# EAGLE design ph762Shield (EAGLE 5.11)
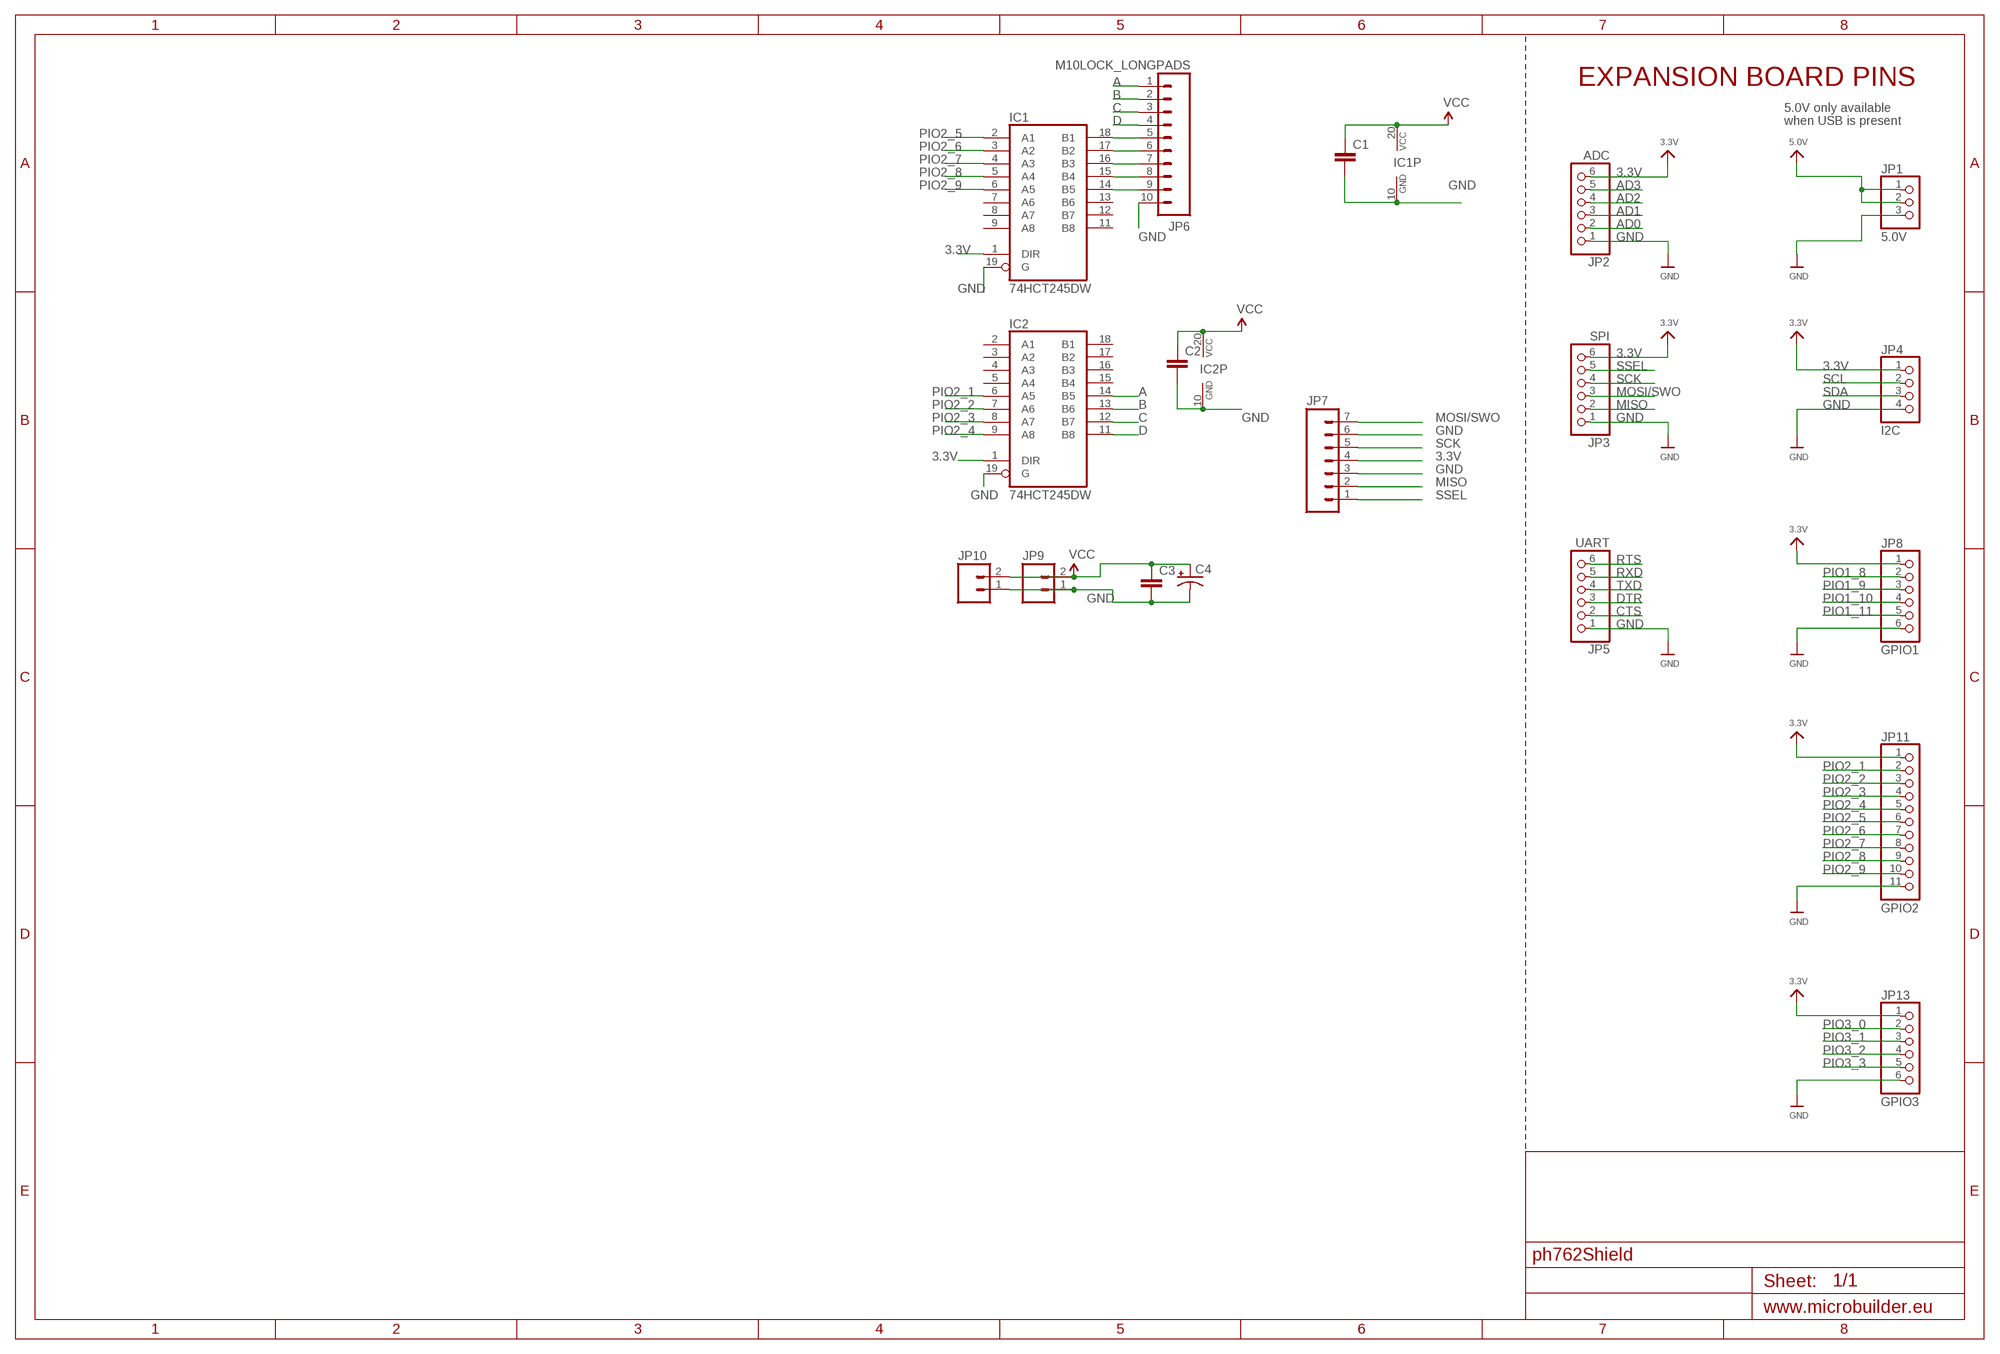
[diagram p0: schematic, sheet 1]

## Parts
C1  CAP0805  [0805]
C2  CAP0805  [0805]
C3  CAP0805  [0805]
C4  CAP_POLC  [PANASONIC_C]
IC1  74HCT245DW  [SO20W]
IC2  74HCT245DW  [SO20W]
JP1  5.0V  HEADER-1X3ROUND  [1X03_ROUND]
JP2  ADC  HEADER-1X6ROUND  [1X06_ROUND]
JP3  SPI  HEADER-1X6ROUND  [1X06_ROUND]
JP4  I2C  HEADER-1X4ROUND  [1X04_ROUND]
JP5  UART  HEADER-1X6ROUND  [1X06_ROUND]
JP6  M10LOCK_LONGPADS  [1X10_LOCK_LONGPADS]
JP7  M07LOCK_LONGPADS  [1X07_LOCK_LONGPADS]
JP8  GPIO1  HEADER-1X6ROUND  [1X06_ROUND]
JP9  M02LOCK_LONGPADS  [1X02_LOCK_LONGPADS]
JP10  M02LOCK_LONGPADS  [1X02_LOCK_LONGPADS]
JP11  GPIO2  HEADER-1X11  [1X11_ROUND]
JP13  GPIO3  HEADER-1X6ROUND  [1X06_ROUND]

## Nets
3.3V: IC1.1(DIR) IC2.1(DIR) JP2.6 JP3.6 JP4.1 JP7.4 JP8.1 JP11.1 JP13.1
5.0V: JP1.1 JP1.2
A: IC2.14(B5) JP6.1
AD0: JP2.2
AD1: JP2.3
AD2: JP2.4
AD3: JP2.5
B: IC2.13(B6) JP6.2
C: IC2.12(B7) JP6.3
CLK: IC1.17(B2) JP6.6
CTS: JP5.2
D: IC2.11(B8) JP6.4
DTR: JP5.3
EN: IC1.14(B5) JP6.9
G: IC1.15(B4) JP6.8
GND: C1.2 C2.2 C3.2 C4.- IC1.10(GND) IC1.19(G) IC2.10(GND) IC2.19(G) JP1.3 JP2.1 JP3.1 JP4.4 JP5.1 JP6.10 JP7.3 JP7.6 JP8.6 JP9.1 JP10.1 JP11.11 JP13.6
MISO: JP3.2 JP7.2
MOSI/SWO: JP3.3 JP7.7
PIO1_8: JP8.2
PIO1_9: JP8.3
PIO1_10: JP8.4
PIO1_11: JP8.5
PIO2_1: IC2.6(A5) JP11.2
PIO2_2: IC2.7(A6) JP11.3
PIO2_3: IC2.8(A7) JP11.4
PIO2_4: IC2.9(A8) JP11.5
PIO2_5: IC1.2(A1) JP11.6
PIO2_6: IC1.3(A2) JP11.7
PIO2_7: IC1.4(A3) JP11.8
PIO2_8: IC1.5(A4) JP11.9
PIO2_9: IC1.6(A5) JP11.10
PIO3_0: JP13.2
PIO3_1: JP13.3
PIO3_2: JP13.4
PIO3_3: JP13.5
R: IC1.16(B3) JP6.7
RTS: JP5.6
RXD: JP5.5
SCK: JP3.4 JP7.5
SCL: JP4.2
SDA: JP4.3
SSEL: JP3.5 JP7.1
STB: IC1.18(B1) JP6.5
TXD: JP5.4
VCC: C1.1 C2.1 C3.1 C4.+ IC1.20(VCC) IC2.20(VCC) JP9.2 JP10.2
Unconnected: IC1.7(A6) IC1.8(A7) IC1.9(A8) IC1.11(B8) IC1.12(B7) IC1.13(B6) IC2.2(A1) IC2.3(A2) IC2.4(A3) IC2.5(A4) IC2.15(B4) IC2.16(B3) IC2.17(B2) IC2.18(B1)

## Notes on the sheet
- EXPANSION BOARD PINS
- 5.0V only available
- when USB is present

## Library data of the parts
C1-C3 = SparkFun:CAP: Capacitor Standard 0603 ceramic capacitor, and 0.1" leaded capacitor.
C4 = SparkFun:CAP_POL: Capacitor Polarized These are standard SMD and PTH capacitors. Normally 10uF, 47uF, and 100uF in electrolytic and tantalum varieties. Always verify the external diameter of the through hole cap, it varies with capacity, voltage, and manufacturer. The EIA devices should be standard.
IC1 IC2 = 74xx-eu:74*245: Octal BUS TRANSCEIVER, 3-state
JP1 = microbuilder:HEADER-1X3: PIN HEADER
JP2 JP3 JP5 JP8 JP13 = microbuilder:HEADER-1X6: PIN HEADER
JP4 = microbuilder:HEADER-1X4: PIN HEADER
JP6 = SparkFun:M10: Header 10 Standard 10-pin 0.1" header. Use with straight break away headers (SKU : PRT-00116), right angle break away headers (PRT-00553), swiss pins (PRT-00743), machine pins (PRT-00117), and female headers (PRT-00115).
JP7 = SparkFun:M07: Header 7 Standard 7-pin 0.1" header. Use with straight break away headers (SKU : PRT-00116), right angle break away headers (PRT-00553), swiss pins (PRT-00743), machine pins (PRT-00117), and female headers (PRT-00115). NOTES ON THE VARIANTS LOCK and LOCK_LONGPADS... This footprint was designed to help hold the alignment of a through-hole component (i.e. 7-pin header) while soldering it into place. You may notice that each hole has been shifted either up or down by 0.005 of an inch from it's more standard position (which is usually a perfectly straight line). This slight alteration caused the pins (the squares in the middle) to touch the edges of the holes. Because they are alternating, it causes a "brace" to hold the header in place. 0.005 has proven to be the perfect amount of "off-center" position when using our standard breakaway headers. Although looks a little odd when you look at the bare footprint, once you have a header in there, the alteration is very hard to notice. Also, if you push a header all the way into place, it is covered up entirely on the bottom side. This idea of altering the position of holes to aid alignment will be further integrated into the Sparkfun Library for other footprints. It can help hold any component with 3 or more connection pins.
JP9 JP10 = SparkFun:M02: Header 2 Standard 2-pin 0.1" header. Use with straight break away headers (SKU : PRT-00116), right angle break away headers (PRT-00553), swiss pins (PRT-00743), machine pins (PRT-00117), and female headers (PRT-00115). Molex polarized connector foot print use with SKU : PRT-08233 with associated crimp pins and housings.
JP11 = microbuilder:HEADER-1X11

## Board
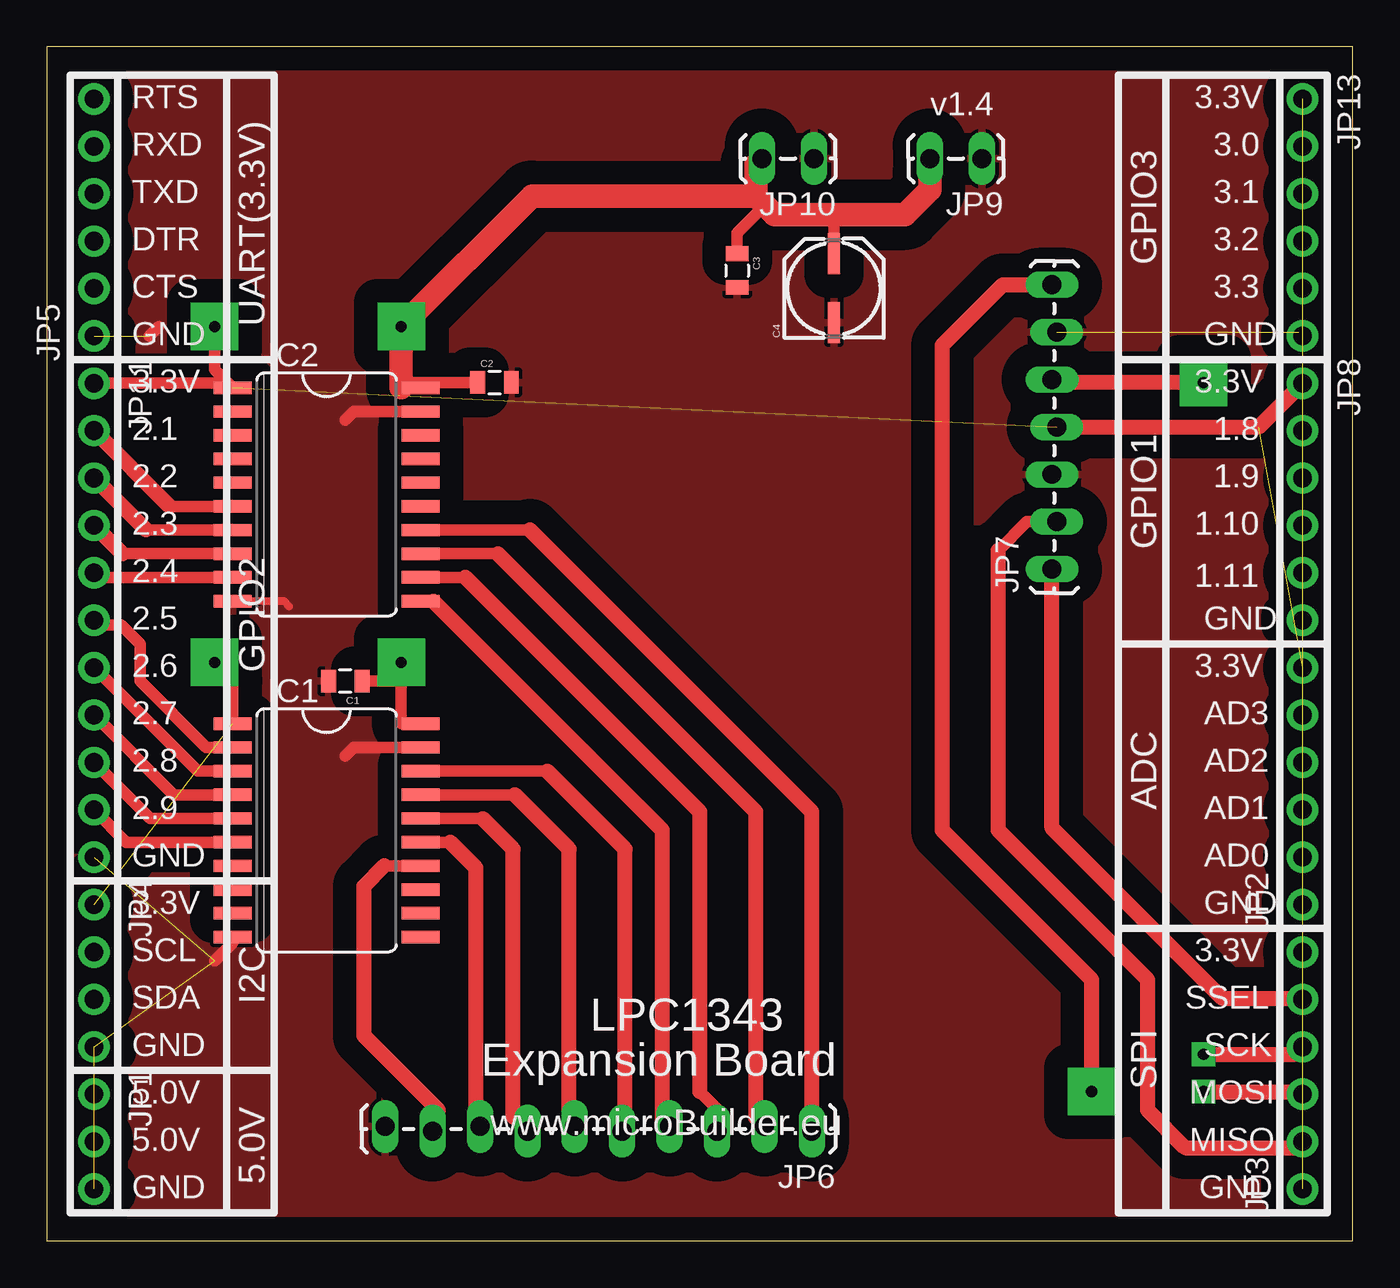
[diagram p1: board, top side]
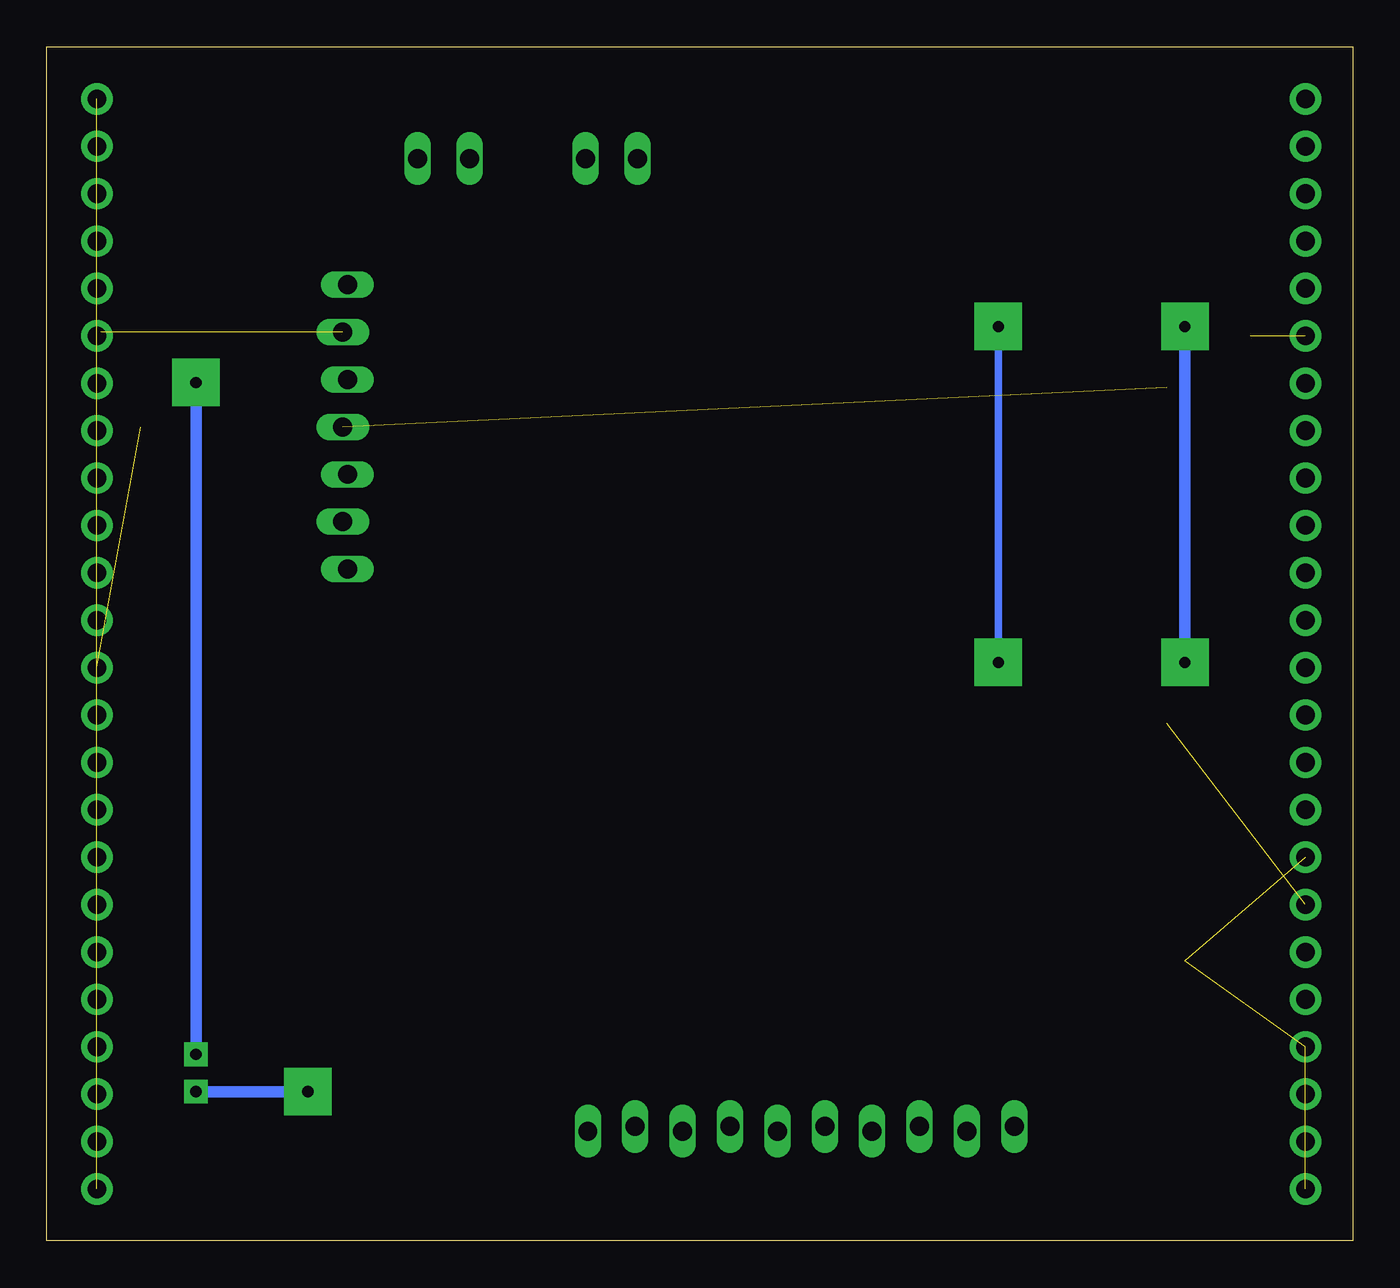
[diagram p2: board, bottom side, seen from below]

Size 70 x 64 mm. Coordinates in mm from the lower left corner, seen from the top.
Outline: 0,0 70,0 70,64 0,64 0,0
Copper layers (1*16): Top 0.035mm / dielectric 1.5mm / Bottom 0.035mm
Design rules "PCBCart-.1mmAnnulars": minimum track width 8mil, minimum drill 0.4mm, track to track 8mil, track to pad 8mil, pad to pad 8mil, via to via 8mil, smd to smd 8mil, copper to edge 20mil, drill to drill 8mil, minimum pad ring 8mil, minimum via ring 4mil, stop-mask expansion 3mil, vias tented up to drill 0mil, thermal gap 8mil
tRestrict: area 2.3,49.4 to 2.7,49.5; area 3.5,48.3 to 3.5,48.7; area 2.3,47.5 to 2.7,47.6; area 4.5,20.4 to 4.5,20.8; area 2.3,19.6 to 2.7,19.6; area 2.3,11.3 to 2.7,11.4; area 3.5,10.2 to 3.5,10.6; area 2.3,9.4 to 2.7,9.5; area 2.3,3.7 to 2.7,3.8; area 3.5,2.6 to 3.5,3; area 2.3,1.8 to 2.7,1.8; area 66.4,2.6 to 66.4,3; 11 more areas

### Footprints (pad centres in the part's own frame; a part is rotated, then mirrored left to right if it is on the bottom)
0805 = smd 0.8 x 1.2: 1 -0.9,0; 2 0.9,0
PANASONIC_C = smd 2.2 x 0.65: + 1.9,-0.2; - -1.8,-0.2
SO20W = smd 0.66 x 2.032: 1 -5.715,-5.029; 2 -4.445,-5.029; 3 -3.175,-5.029; 4 -1.905,-5.029; 5 -0.635,-5.029; 6 0.635,-5.029; 7 1.905,-5.029; 8 3.175,-5.029; 9 4.445,-5.029; 10 5.715,-5.029; 11 5.715,5.029; 12 4.445,5.029; 13 3.175,5.029; 14 1.905,5.029; 15 0.635,5.029; 16 -0.635,5.029; 17 -1.905,5.029; 18 -3.175,5.029; 19 -4.445,5.029; 20 -5.715,5.029
1X03_ROUND = drill 1 pad 1.676 round: 1 -2.54,0; 2 0,0; 3 2.54,0
1X06_ROUND = drill 1 pad 1.676 round: 1 -6.35,0; 2 -3.81,0; 3 -1.27,0; 4 1.27,0; 5 3.81,0; 6 6.35,0
1X04_ROUND = drill 1 pad 1.676 round: 1 -3.81,0; 2 -1.27,0; 3 1.27,0; 4 3.81,0
1X10_LOCK_LONGPADS = drill 1.016 long: 1 0,0.127; 2 2.54,-0.127; 3 5.08,0.127; 4 7.62,-0.127; 5 10.16,0.127; 6 12.7,-0.127; 7 15.24,0.127; 8 17.78,-0.127; 9 20.32,0.127; 10 22.86,-0.127
1X07_LOCK_LONGPADS = drill 1.016 long: 1 0,0.127; 2 2.54,-0.127; 3 5.08,0.127; 4 7.62,-0.127; 5 10.16,0.127; 6 12.7,-0.127; 7 15.24,0.127
1X02_LOCK_LONGPADS = drill 1.016 long: 1 -0.127,0; 2 2.667,0
1X11_ROUND = drill 1 pad 1.676 round: 1 -12.7,0; 2 -10.16,0; 3 -7.62,0; 4 -5.08,0; 5 -2.54,0; 6 0,0; 7 2.54,0; 8 5.08,0; 9 7.62,0; 10 10.16,0; 11 12.7,0

### Placement (x,y rotation side)
C1  16,30 180 top
C2  24,46 0 top
C3  37,52 270 top
C4  42,51 90 top
IC1  15,22 270 top
IC2  15,40 270 top
JP1  2.54,5.32 270 top
JP2  67.31,24.37 90 top
JP3  67.31,9.13 90 top
JP4  2.54,14.21 270 top
JP5  2.54,54.85 90 top
JP6  41,6 180 top
JP7  54,36 90 top
JP8  67.31,39.61 270 top
JP9  50,58 180 top
JP10  41,58 180 top
JP11  2.54,33.26 270 top
JP13  67.31,54.85 270 top

### Tracks (layer width: path | path; a pad name or v marks a point on that pad's centre or on a via)
3.3V  (via drill 0.6 pad 2.54)  (5 unrouted)
  Top 0.61: JP11.1 9.73,45.96 IC2.1 9,46.69 v9,49 | IC1.1 9.97,30.03 v9,31
  Top 0.813: JP7.4 64.97,43.62 JP8.1
  Bottom 0.61: v9,31 v9,49
5.0V  (1 unrouted)
A
  Top 0.61: 25.91,38.09 IC2.14
  Top 0.813: 25.91,38.09 41,23 JP6.1
B
  Top 0.61: 24.18,36.83 IC2.13 | 38,6.59 JP6.2
  Top 0.813: 24.18,36.83 38,23 38,6.59
C
  Top 0.61: 22.45,35.55 IC2.12 | 35,8 36,7 36,5.95 JP6.3
  Top 0.813: 22.45,35.55 35,23 35,8
CLK
  Top 0.61: 25.09,23.91 IC1.17 | JP6.6 28,6.43
  Top 0.813: 25.09,23.91 28,21 28,6.43
D
  Top 0.61: 20.71,34.28 IC2.11 | 33,6.51 JP6.4
  Top 0.813: 20.71,34.28 33,22 33,6.51
EN
  Top 0.61: 18.09,20.09 IC1.14 | 21,7 21,6.19 JP6.9
  Top 0.813: 18.09,20.09 17,19 17,11 21,7
G
  Top 0.61: 21.64,21.37 IC1.15 | JP6.8 23,6.35
  Top 0.813: 21.64,21.37 23,20 23,6.35
GND  (8 unrouted)
  Top 0.406: IC2.10 12.71,34.28 13,34
  Top 0.61: JP13.6 67.11,48.7 | 5.5,48.5 6,49 | IC1.10 9.97,15.97 9,15 | IC1.19 16.45,26.45 16,26 | IC2.19 16.45,44.45 16,44
  pour Top (isolate 1.27): 0.25,63.87 70.23,63.87 69.73,0.24 0,0.24 0,63.76
MISO
  Top 0.61: JP7.2 52.54,38.54 51,37 | 66.99,5 JP3.2
  Top 0.813: 51,37 51,22 59,14 59,7 61,5 66.99,5
MOSI/SWO  (via drill 0.6 pad 1.27, 0.6 pad 2.54)
  Top 0.61: 67.17,8 JP3.3
  Top 0.813: JP7.7 51.24,51.24 48,48 48,22 56,14 v56,8 | v62,8 67.17,8
  Bottom 0.61: v56,8 v62,8
PIO2_1
  Top 0.61: 6.59,39.37 IC2.6
  Top 0.813: 6.59,39.37 JP11.2
PIO2_2
  Top 0.61: 5.33,38.09 IC2.7
  Top 0.813: 5.33,38.09 JP11.3
PIO2_3
  Top 0.61: 4.05,36.83 IC2.8
  Top 0.813: 4.05,36.83 JP11.4
PIO2_4
  Top 0.61: IC2.9 2.79,35.55 JP11.5
PIO2_5
  Top 0.61: IC1.2 8.55,26.45 5,30 5,32 4,33 2.8,33 JP11.6
PIO2_6
  Top 0.61: IC1.3 8.09,25.17 JP11.7
PIO2_7
  Top 0.61: IC1.4 6.82,23.91 JP11.8
PIO2_8
  Top 0.61: IC1.5 5.54,22.63 JP11.9
PIO2_9
  Top 0.61: IC1.6 4.28,21.37 JP11.10
R
  Top 0.61: 23.36,22.63 IC1.16 | 25,6.63 JP6.7
  Top 0.813: 23.36,22.63 25,21 25,6.63
SCK  (via drill 0.6 pad 1.27, 0.6 pad 2.54)
  Top 0.61: JP7.5 53.87,46.13 54,46 | 66.91,10 JP3.4
  Top 0.813: v62,46 54,46 | v62,10 66.91,10
  Bottom 0.61: v62,10 v62,46
SSEL
  Top 0.61: 67.25,13 JP3.5
  Top 0.813: JP7.1 53.87,22.13 63,13 67.25,13
STB
  Top 0.61: 26.82,25.17 IC1.18 | JP6.5 31,6.03
  Top 0.813: 26.82,25.17 31,21 31,6.03
VCC  (via drill 0.6 pad 2.54)
  Top 0.406: 19,27.72 IC1.20 | 19,45.72 IC2.20 | v19,49 18.33,48.67
  Top 0.61: 19,27.72 v19,31 19,30 C1.1 | 19,46 C2.1 | C3.1 37,54 38.5,55.5 | C4.+ 42.2,54.8 42,55
  Top 1.27: 19,45.72 19,46 v19,49 26,56 38,56 | 47.33,57.33 JP9.2 47.33,56.33 46,55 42,55 39,55 38.5,55.5 38,56 | 38,56 38,57.67 JP10.2
  Bottom 0.406: v19,31 v19,49

### Text on the board
tPlace: RTS | 3.3V | v1.4 | RXD | 3.0 | TXD | 3.1 | DTR | 3.2 | GPIO3 | CTS | 3.3 | UART(3.3V) | GND | GND | 3.3V | 3.3V | 2.1 | 1.8 | 2.2 | 1.9 | 2.3 | 1.10 | GPIO1 | 2.4 | 1.11 | 2.5 | GND | 2.6 | GPIO2 | 3.3V | 2.7 | AD3 | 2.8 | AD2 | 2.9 | ADC | AD1 | GND | AD0 | 3.3V | GND | SCL | 3.3V | I2C | SDA | SSEL | LPC1343 | GND | SCK | Expansion Board | SPI | 5.0V | MOSI | www.microBuilder.eu | 5.0V | MISO | 5.0V | GND | GND